# EAGLE design XBee Breakout Board (EAGLE 7.6.0)
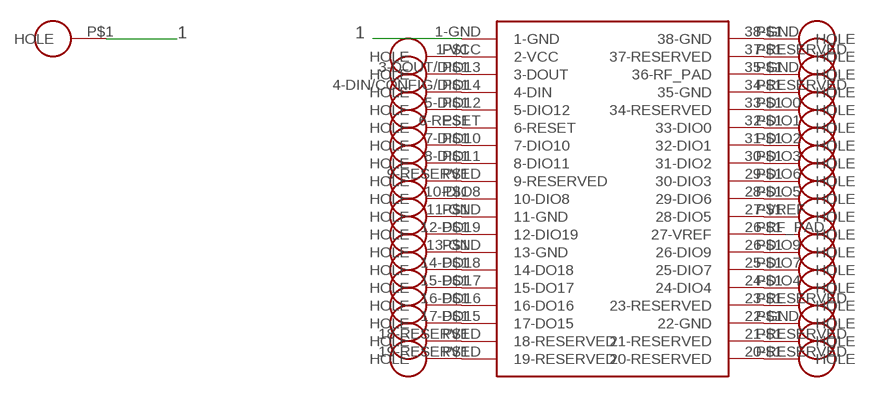
[diagram p0: schematic, sheet 1]

## Parts
U$1  XBEE  [XBEE]
U$2  HEADER-HOLE  [HEADER-HOLE]
U$3  HEADER-HOLE  [HEADER-HOLE]
U$4  HEADER-HOLE  [HEADER-HOLE]
U$5  HEADER-HOLE  [HEADER-HOLE]
U$6  HEADER-HOLE  [HEADER-HOLE]
U$7  HEADER-HOLE  [HEADER-HOLE]
U$8  HEADER-HOLE  [HEADER-HOLE]
U$9  HEADER-HOLE  [HEADER-HOLE]
U$10  HEADER-HOLE  [HEADER-HOLE]
U$11  HEADER-HOLE  [HEADER-HOLE]
U$12  HEADER-HOLE  [HEADER-HOLE]
U$13  HEADER-HOLE  [HEADER-HOLE]
U$14  HEADER-HOLE  [HEADER-HOLE]
U$15  HEADER-HOLE  [HEADER-HOLE]
U$16  HEADER-HOLE  [HEADER-HOLE]
U$17  HEADER-HOLE  [HEADER-HOLE]
U$18  HEADER-HOLE  [HEADER-HOLE]
U$19  HEADER-HOLE  [HEADER-HOLE]
U$20  HEADER-HOLE  [HEADER-HOLE]
U$21  HEADER-HOLE  [HEADER-HOLE]
U$22  HEADER-HOLE  [HEADER-HOLE]
U$23  HEADER-HOLE  [HEADER-HOLE]
U$24  HEADER-HOLE  [HEADER-HOLE]
U$25  HEADER-HOLE  [HEADER-HOLE]
U$26  HEADER-HOLE  [HEADER-HOLE]
U$27  HEADER-HOLE  [HEADER-HOLE]
U$28  HEADER-HOLE  [HEADER-HOLE]
U$29  HEADER-HOLE  [HEADER-HOLE]
U$30  HEADER-HOLE  [HEADER-HOLE]
U$31  HEADER-HOLE  [HEADER-HOLE]
U$32  HEADER-HOLE  [HEADER-HOLE]
U$33  HEADER-HOLE  [HEADER-HOLE]
U$34  HEADER-HOLE  [HEADER-HOLE]
U$35  HEADER-HOLE  [HEADER-HOLE]
U$36  HEADER-HOLE  [HEADER-HOLE]
U$37  HEADER-HOLE  [HEADER-HOLE]
U$38  HEADER-HOLE  [HEADER-HOLE]
U$39  HEADER-HOLE  [HEADER-HOLE]

## Nets
1: U$1.1-GND U$2.P$1(HOLE)
N$1: U$1.1-VCC(2-VCC) U$3.P$1(HOLE)
N$2: U$1.3-DOUT/DIO13(3-DOUT) U$4.P$1(HOLE)
N$3: U$1.4-DIN/CONFIG/DIO14(4-DIN) U$5.P$1(HOLE)
N$4: U$1.5-DIO12 U$6.P$1(HOLE)
N$5: U$1.6-RESET U$7.P$1(HOLE)
N$6: U$1.7-DIO10 U$8.P$1(HOLE)
N$7: U$1.8-DIO11 U$9.P$1(HOLE)
N$8: U$1.9-RESERVED U$10.P$1(HOLE)
N$9: U$1.10-DIO8 U$11.P$1(HOLE)
N$10: U$1.11-GND U$12.P$1(HOLE)
N$11: U$1.12-DO19(12-DIO19) U$13.P$1(HOLE)
N$12: U$1.13-GND U$14.P$1(HOLE)
N$13: U$1.14-DO18 U$15.P$1(HOLE)
N$14: U$1.15-DO17 U$16.P$1(HOLE)
N$15: U$1.16-DO16 U$17.P$1(HOLE)
N$16: U$1.17-DO15 U$18.P$1(HOLE)
N$17: U$1.18-RESERVED U$19.P$1(HOLE)
N$18: U$1.19-RESERVED U$20.P$1(HOLE)
N$19: U$1.38-GND U$21.P$1(HOLE)
N$20: U$1.37-RESERVED U$22.P$1(HOLE)
N$21: U$1.35-GND(36-RF_PAD) U$23.P$1(HOLE)
N$22: U$1.34-RESERVED(35-GND) U$24.P$1(HOLE)
N$23: U$1.33-DIO0(34-RESERVED) U$25.P$1(HOLE)
N$24: U$1.32-DIO1(33-DIO0) U$26.P$1(HOLE)
N$25: U$1.31-DIO2(32-DIO1) U$27.P$1(HOLE)
N$26: U$1.30-DIO3(31-DIO2) U$28.P$1(HOLE)
N$27: U$1.29-DIO6(30-DIO3) U$29.P$1(HOLE)
N$28: U$1.28-DIO5(29-DIO6) U$30.P$1(HOLE)
N$29: U$1.27-VREF(28-DIO5) U$31.P$1(HOLE)
N$30: U$1.26-RF_PAD(27-VREF) U$32.P$1(HOLE)
N$31: U$1.26-DIO9 U$33.P$1(HOLE)
N$32: U$1.25-DIO7 U$34.P$1(HOLE)
N$33: U$1.23-RESERVED U$35.P$1(HOLE)
N$34: U$1.24-DIO4 U$36.P$1(HOLE)
N$35: U$1.21-RESERVED U$37.P$1(HOLE)
N$36: U$1.22-GND U$38.P$1(HOLE)
N$37: U$1.20-RESERVED U$39.P$1(HOLE)

## Library data of the parts
U$1 = RocketControlBoard:XBEE
U$2-U$39 = RocketControlBoard:HEADER-HOLE

## Board
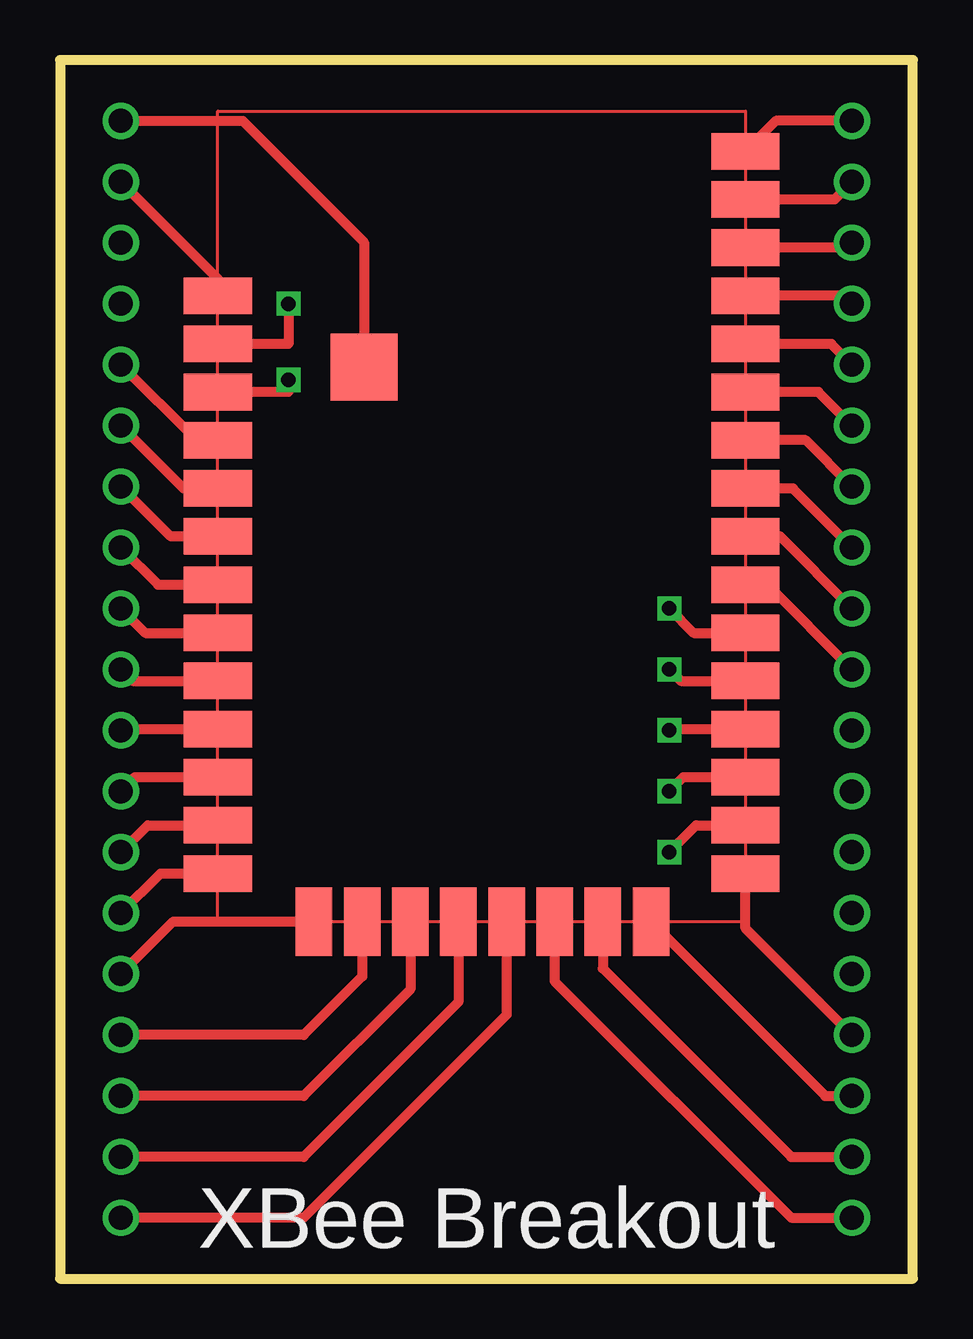
[diagram p1: board, top side]
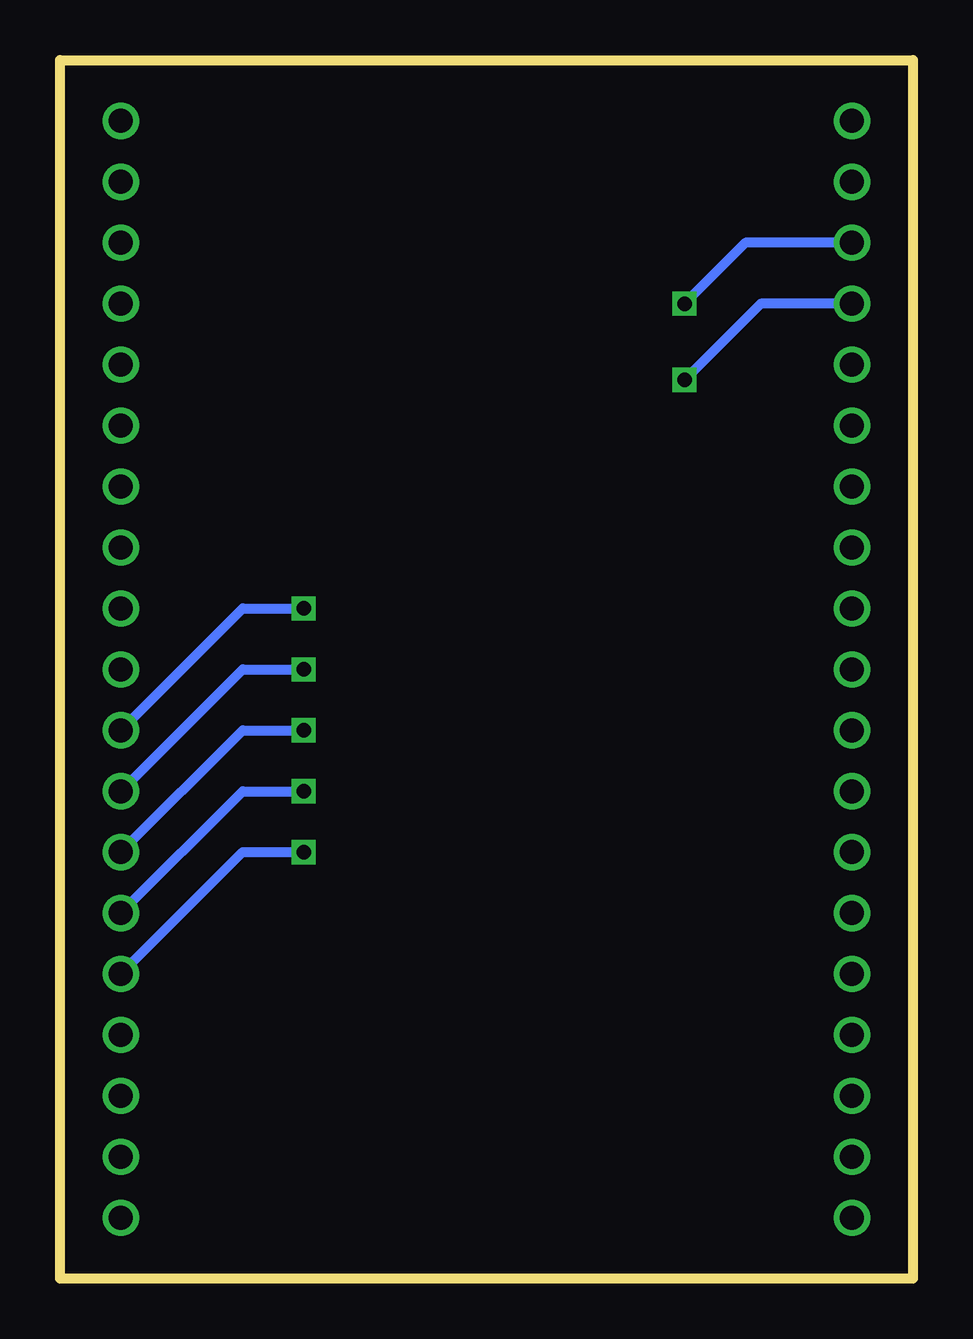
[diagram p2: board, bottom side, seen from below]

Size 35.56 x 50.8 mm. Coordinates in mm from the lower left corner, seen from the top.
Outline: 0,0 35.56,0 35.56,50.8 0,50.8 0,0
Copper layers (1*16): Top 0.035mm / dielectric 1.5mm / Bottom 0.035mm
Design rules "default": minimum track width 10mil, minimum drill 24mil, track to track 8mil, track to pad 8mil, pad to pad 8mil, via to via 8mil, smd to smd 8mil, copper to edge 40mil, drill to drill 8mil, minimum pad ring 10mil, minimum via ring 8mil, stop-mask expansion 4mil, vias tented up to drill 0mil, thermal gap 10mil

### Footprints (pad centres in the part's own frame; a part is rotated, then mirrored left to right if it is on the bottom)
XBEE = smd 2.845 x 1.524: 1-GND -21.996,-6.02; 1-VCC -21.996,-8.026; 3-DOUT/DIO13 -21.996,-10.033; 4-DIN/CONFIG/DIO14 -21.996,-12.04; 5-DIO12 -21.996,-14.046; 6-RESET -21.996,-16.053; 7-DIO10 -21.996,-18.059; 8-DIO11 -21.996,-20.066; 9-RESERVED -21.996,-22.073; 10-DIO8 -21.996,-24.079; 11-GND -21.996,-26.086; 12-DO19 -21.996,-28.092; 13-GND -21.996,-30.099; 22-GND 0,-30.099; 23-RESERVED 0,-28.092; 24-DIO4 0,-26.086; 25-DIO7 0,-24.079; 26-DIO9 0,-22.073; 26-RF_PAD 0,-2.007; 27-VREF 0,-20.066; 28-DIO5 0,-18.059; 29-DIO6 0,-16.053; 30-DIO3 0,-14.046; 31-DIO2 0,-12.04; 32-DIO1 0,-10.033; 33-DIO0 0,-8.026; 34-RESERVED 0,-6.02; 35-GND 0,-4.013; 37-RESERVED 0,0 | smd 1.524 x 2.845: 14-DO18 -17.983,-32.106; 15-DO17 -15.977,-32.106; 16-DO16 -13.97,-32.106; 17-DO15 -11.963,-32.106; 18-RESERVED -9.957,-32.106; 19-RESERVED -7.95,-32.106; 20-RESERVED -5.944,-32.106; 21-RESERVED -3.937,-32.106 | smd 2.794 x 2.794: 38-GND -15.9,-8.992
HEADER-HOLE = drill 1: P$1 0,0

### Placement (x,y rotation side)
U$1  28.57,46.99 0 top
U$2  2.54,45.72 0 top
U$3  2.54,43.18 0 top
U$4  2.54,40.64 0 top
U$5  2.54,38.1 0 top
U$6  2.54,35.56 0 top
U$7  2.54,33.02 0 top
U$8  2.54,30.48 0 top
U$9  2.54,27.94 0 top
U$10  2.54,25.4 0 top
U$11  2.54,22.86 0 top
U$12  2.54,20.32 0 top
U$13  2.54,17.78 0 top
U$14  2.54,15.24 0 top
U$15  2.54,12.7 0 top
U$16  2.54,10.16 0 top
U$17  2.54,7.62 0 top
U$18  2.54,5.08 0 top
U$19  2.54,2.54 0 top
U$20  33.02,2.54 0 top
U$21  2.54,48.26 0 top
U$22  33.02,48.26 0 top
U$23  33.02,43.18 0 top
U$24  33.02,40.64 0 top
U$25  33.02,38.1 0 top
U$26  33.02,35.56 0 top
U$27  33.02,33.02 0 top
U$28  33.02,30.48 0 top
U$29  33.02,27.94 0 top
U$30  33.02,25.4 0 top
U$31  33.02,22.86 0 top
U$32  33.02,45.72 0 top
U$33  33.02,20.32 0 top
U$34  33.02,17.78 0 top
U$35  33.02,12.7 0 top
U$36  33.02,15.24 0 top
U$37  33.02,7.62 0 top
U$38  33.02,10.16 0 top
U$39  33.02,5.08 0 top

### Tracks (layer width: path | path; a pad name or v marks a point on that pad's centre or on a via)
1
  Top 0.406: U$2.P$1 6.58,41.68 U$1.1-GND
N$1  (via drill 0.6)
  Top 0.406: v9.53,40.64 9.53,38.96 U$1.1-VCC
  Bottom 0.406: U$3.P$1 6.99,43.18 v9.53,40.64
N$2  (via drill 0.6)
  Top 0.406: v9.53,37.47 9.53,36.96 U$1.3-DOUT/DIO13
  Bottom 0.406: U$4.P$1 6.35,40.64 v9.53,37.47
N$3
  Top 0.406: U$1.4-DIN/CONFIG/DIO14 5.69,34.95 U$5.P$1
N$4
  Top 0.406: U$6.P$1 5.16,32.94 U$1.5-DIO12
N$5
  Top 0.406: U$1.6-RESET 4.62,30.94 U$7.P$1
N$6
  Top 0.406: U$8.P$1 4.09,28.93 U$1.7-DIO10
N$7
  Top 0.406: U$9.P$1 3.56,26.92 U$1.8-DIO11
N$8
  Top 0.406: U$10.P$1 3.02,24.92 U$1.9-RESERVED
N$9
  Top 0.406: U$11.P$1 2.59,22.91 U$1.10-DIO8
N$10
  Top 0.406: U$12.P$1 3.12,20.9 U$1.11-GND
N$11
  Top 0.406: U$13.P$1 3.66,18.9 U$1.12-DO19
N$12
  Top 0.406: U$14.P$1 4.19,16.89 U$1.13-GND
N$13
  Top 0.406: U$15.P$1 4.72,14.88 U$1.14-DO18
N$14
  Top 0.406: U$1.15-DO17 12.6,12.6 10.16,10.16 U$16.P$1
N$15
  Top 0.406: U$1.16-DO16 14.61,12.06 10.16,7.62 U$17.P$1
N$16
  Top 0.406: U$1.17-DO15 16.61,11.53 10.16,5.08 U$18.P$1
N$17
  Top 0.406: U$1.18-RESERVED 18.62,11 10.16,2.54 U$19.P$1
N$18
  Top 0.406: U$1.19-RESERVED 20.62,12.39 30.48,2.54 U$20.P$1
N$19
  Top 0.406: U$21.P$1 7.62,48.26 12.68,43.2 U$1.38-GND
N$20
  Top 0.406: U$22.P$1 29.84,48.26 U$1.37-RESERVED
N$21
  Top 0.406: U$23.P$1 32.82,42.98 U$1.35-GND
N$22
  Top 0.406: U$24.P$1 32.69,40.97 U$1.34-RESERVED
N$23
  Top 0.406: U$25.P$1 32.16,38.96 U$1.33-DIO0
N$24
  Top 0.406: U$26.P$1 31.62,36.96 U$1.32-DIO1
N$25
  Top 0.406: U$27.P$1 31.09,34.95 U$1.31-DIO2
N$26
  Top 0.406: U$28.P$1 30.56,32.94 U$1.30-DIO3
N$27
  Top 0.406: U$29.P$1 30.02,30.94 U$1.29-DIO6
N$28
  Top 0.406: U$30.P$1 29.49,28.93 U$1.28-DIO5
N$29  (via drill 0.6)
  Top 0.406: v25.4,27.94 26.42,26.92 U$1.27-VREF
  Bottom 0.406: U$31.P$1 27.94,27.94 v25.4,27.94
N$30
  Top 0.406: U$32.P$1 32.28,44.98 U$1.26-RF_PAD
N$31  (via drill 0.6)
  Top 0.406: v25.4,25.4 25.88,24.92 U$1.26-DIO9
  Bottom 0.406: U$33.P$1 27.94,25.4 v25.4,25.4
N$32  (via drill 0.6)
  Top 0.406: v25.4,22.86 25.45,22.91 U$1.25-DIO7
  Bottom 0.406: U$34.P$1 27.94,22.86 v25.4,22.86
N$33  (via drill 0.6)
  Top 0.406: v25.4,17.78 26.52,18.9 U$1.23-RESERVED
  Bottom 0.406: U$35.P$1 27.94,17.78 v25.4,17.78
N$34  (via drill 0.6)
  Top 0.406: v25.4,20.32 25.98,20.9 U$1.24-DIO4
  Bottom 0.406: U$36.P$1 27.94,20.32 v25.4,20.32
N$35
  Top 0.406: U$1.21-RESERVED 31.9,7.62 U$37.P$1
N$36
  Top 0.406: U$38.P$1 28.57,14.61 U$1.22-GND
N$37
  Top 0.406: U$1.20-RESERVED 22.63,12.93 30.48,5.08 U$39.P$1

### Text on the board
tPlace: XBee Breakout